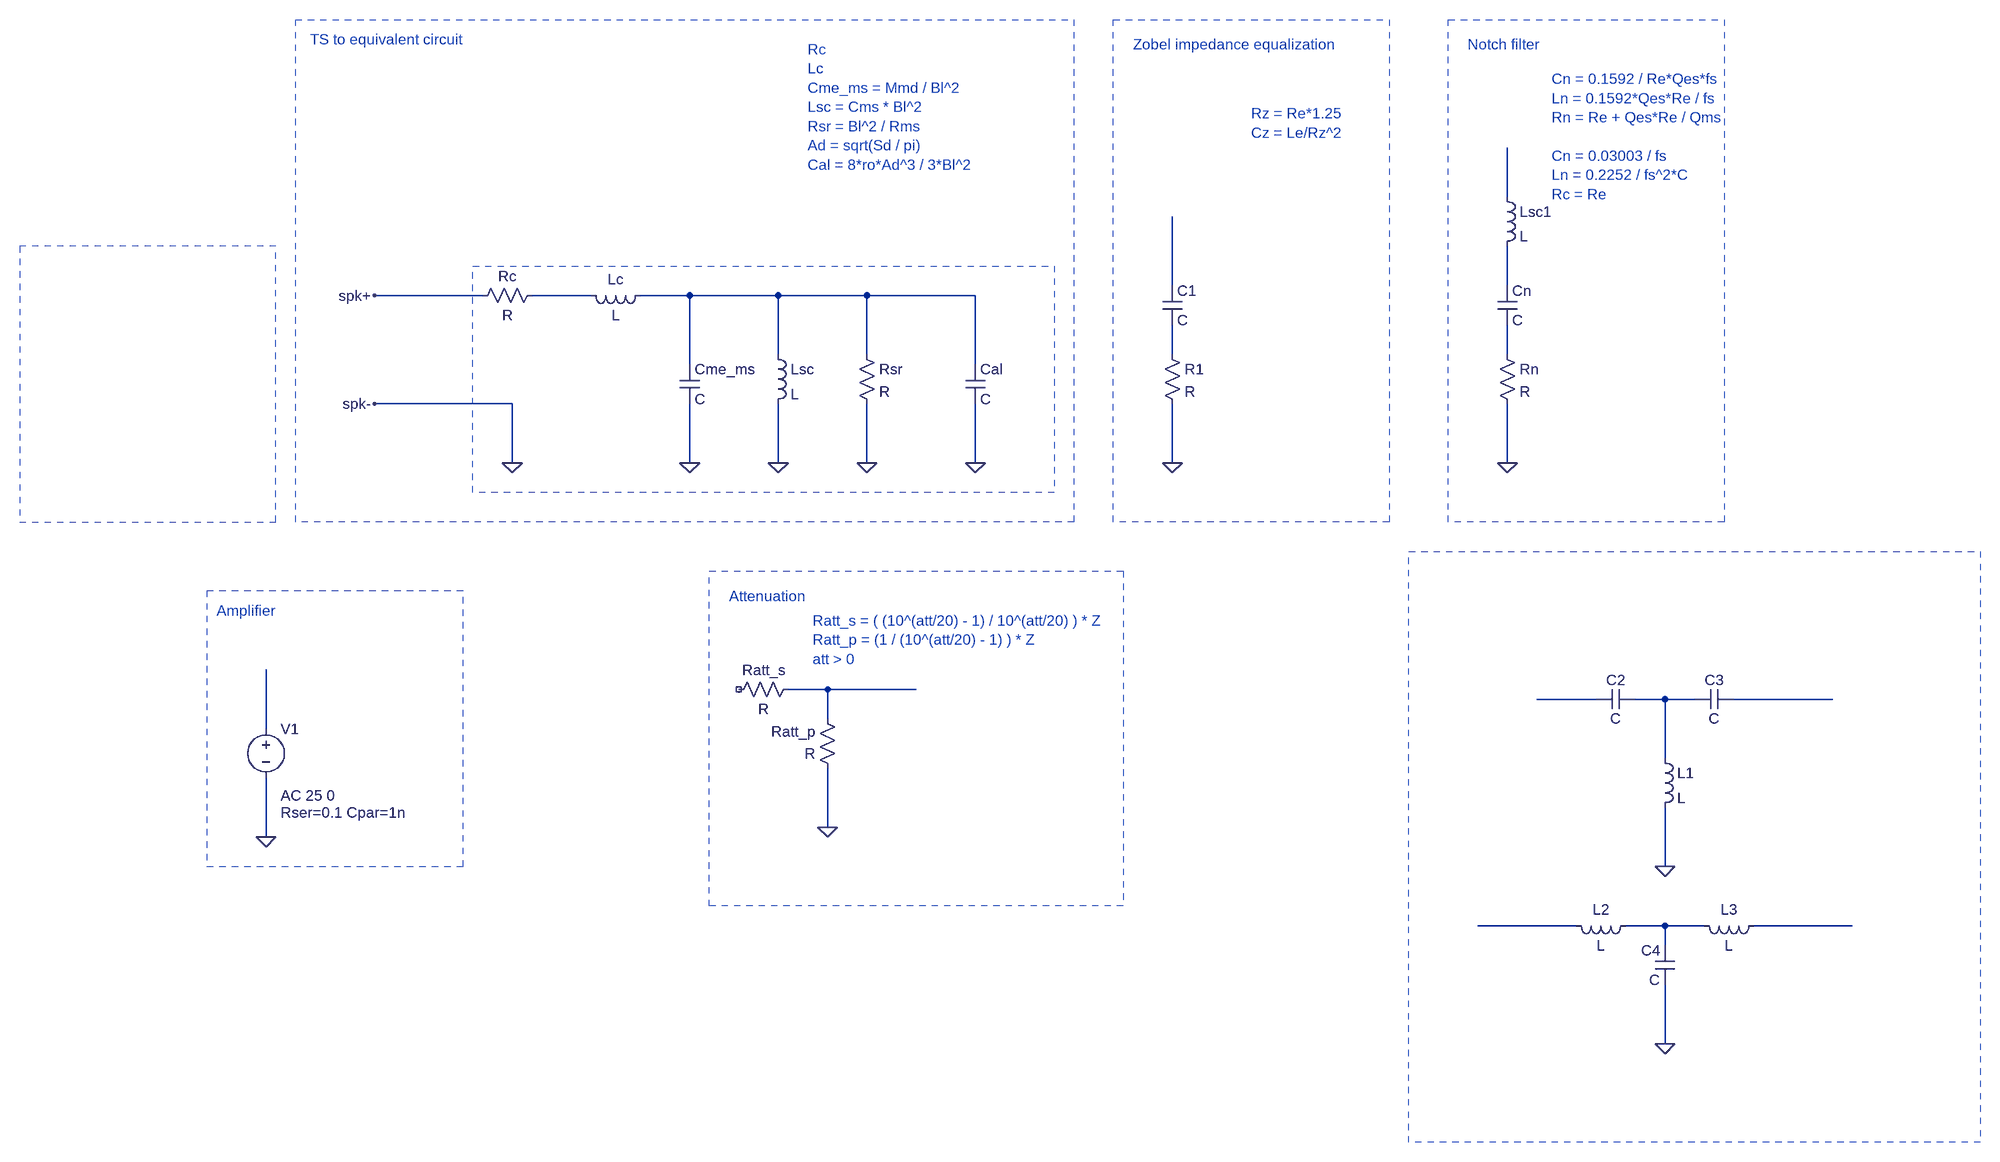
[diagram p0: schematic passive-audio-circuits.asc]
passive-audio-circuits.asc, the LTspice schematic file:
Version 4
SHEET 1 2452 1460
WIRE 1680 -80 1680 -160
WIRE 1136 64 1136 -48
WIRE 1680 64 1680 0
WIRE 16 80 -160 80
WIRE 192 80 96 80
WIRE 352 80 272 80
WIRE 496 80 352 80
WIRE 640 80 496 80
WIRE 816 80 640 80
WIRE 496 176 496 80
WIRE 640 176 640 80
WIRE 1136 176 1136 128
WIRE 1680 176 1680 128
WIRE 352 192 352 80
WIRE 816 192 816 80
WIRE 64 256 -160 256
WIRE 64 352 64 256
WIRE 352 352 352 256
WIRE 496 352 496 256
WIRE 640 352 640 256
WIRE 816 352 816 256
WIRE 1136 352 1136 256
WIRE 1680 352 1680 256
WIRE 576 720 512 720
WIRE 720 720 576 720
WIRE 1824 736 1728 736
WIRE 1936 736 1888 736
WIRE 1984 736 1936 736
WIRE 2208 736 2048 736
WIRE 576 768 576 720
WIRE -336 784 -336 688
WIRE 1936 832 1936 736
WIRE 576 944 576 848
WIRE -336 960 -336 864
WIRE 1936 1008 1936 912
WIRE 1792 1104 1632 1104
WIRE 1936 1104 1872 1104
WIRE 2000 1104 1936 1104
WIRE 2240 1104 2080 1104
WIRE 1936 1136 1936 1104
WIRE 1936 1296 1936 1200
FLAG 352 352 0
FLAG 496 352 0
FLAG 640 352 0
FLAG 816 352 0
FLAG -336 960 0
FLAG 1136 352 0
FLAG 64 352 0
FLAG -160 80 spk+
FLAG -160 256 spk-
FLAG 576 944 0
FLAG 1680 352 0
FLAG 1936 1296 0
FLAG 1936 1008 0
SYMBOL res 112 64 R90
WINDOW 0 0 56 VBottom 2
WINDOW 3 32 56 VTop 2
SYMATTR InstName Rc
SYMBOL res 624 160 R0
SYMATTR InstName Rsr
SYMBOL ind 288 64 R90
WINDOW 0 5 56 VBottom 2
WINDOW 3 32 56 VTop 2
SYMATTR InstName Lc
SYMBOL ind 480 160 R0
SYMATTR InstName Lsc
SYMBOL cap 336 192 R0
SYMATTR InstName Cme_ms
SYMBOL cap 800 192 R0
SYMATTR InstName Cal
SYMBOL voltage -336 768 R0
WINDOW 123 24 124 Left 2
WINDOW 39 24 152 Left 2
SYMATTR Value2 AC 25 0
SYMATTR SpiceLine Rser=0.1 Cpar=1n
SYMATTR InstName V1
SYMATTR Value ""
SYMBOL cap 1120 64 R0
SYMATTR InstName C1
SYMBOL res 1120 160 R0
SYMATTR InstName R1
SYMBOL res 528 704 R90
WINDOW 0 0 56 VBottom 2
WINDOW 3 32 56 VTop 2
SYMATTR InstName Ratt_s
SYMBOL res 592 864 R180
WINDOW 0 36 76 Left 2
WINDOW 3 36 40 Left 2
SYMATTR InstName Ratt_p
SYMBOL cap 1664 64 R0
SYMATTR InstName Cn
SYMBOL res 1664 160 R0
SYMATTR InstName Rn
SYMBOL ind 1664 -96 R0
SYMATTR InstName Lsc1
SYMBOL cap 1888 720 R90
WINDOW 0 0 32 VBottom 2
WINDOW 3 32 32 VTop 2
SYMATTR InstName C2
SYMBOL cap 2048 720 R90
WINDOW 0 0 32 VBottom 2
WINDOW 3 32 32 VTop 2
SYMATTR InstName C3
SYMBOL cap 1952 1200 R180
WINDOW 0 24 56 Left 2
WINDOW 3 24 8 Left 2
SYMATTR InstName C4
SYMBOL ind 1920 816 R0
SYMATTR InstName L1
SYMBOL ind 1888 1088 R90
WINDOW 0 5 56 VBottom 2
WINDOW 3 32 56 VTop 2
SYMATTR InstName L2
SYMBOL ind 2096 1088 R90
WINDOW 0 5 56 VBottom 2
WINDOW 3 32 56 VTop 2
SYMATTR InstName L3
TEXT 544 -320 Left 2 ;Rc\nLc\nCme_ms = Mmd / Bl^2\nLsc = Cms * Bl^2\nRsr = Bl^2 / Rms\nAd = sqrt(Sd / pi)\nCal = 8*ro*Ad^3 / 3*Bl^2
TEXT -264 -336 Left 2 ;TS to equivalent circuit
TEXT 1264 -216 Left 2 ;Rz = Re*1.25\nCz = Le/Rz^2
TEXT 1072 -328 Left 2 ;Zobel impedance equalization
TEXT -416 592 Left 2 ;Amplifier
TEXT 416 568 Left 2 ;Attenuation
TEXT 552 608 Left 2 ;Ratt_s = ( (10^(att/20) - 1) / 10^(att/20) ) * Z\nRatt_p = (1 / (10^(att/20) - 1) ) * Z\natt > 0
TEXT 1752 -272 Left 2 ;Cn = 0.1592 / Re*Qes*fs\nLn = 0.1592*Qes*Re / fs\nRn = Re + Qes*Re / Qms\n \nCn = 0.03003 / fs\nLn = 0.2252 / fs^2*C\nRc = Re
TEXT 1616 -328 Left 2 ;Notch filter
RECTANGLE Normal 976 448 -288 -368 2
RECTANGLE Normal 1488 448 1040 -368 2
RECTANGLE Normal 944 400 0 32 2
RECTANGLE Normal -16 560 -432 1008 2
RECTANGLE Normal -320 0 -736 448 2
RECTANGLE Normal 1056 1072 384 528 2
RECTANGLE Normal 2032 448 1584 -368 2
RECTANGLE Normal 2448 1456 1520 496 2

The netlist it stands for:
* passive-audio-circuits.asc
Rc N004 spk+ R
Rsr N005 0 R
Lc N005 N004 L
Lsc N005 0 L
Cme_ms N005 0 C
Cal N005 0 C
V1 N012 0 AC 25 0 Rser=0.1 Cpar=1n
C1 N002 N006 C
R1 N006 0 R
Ratt_s N008 NC_01 R
Ratt_p 0 N008 R
Cn N003 N007 C
Rn N007 0 R
Lsc1 N001 N003 L
C2 N010 N009 C
C3 N011 N010 C
C4 0 N014 C
L1 N010 0 L
L2 N014 N013 L
L3 N015 N014 L
* Rc
* Lc
* Cme_ms = Mmd / Bl^2
* Lsc = Cms * Bl^2
* Rsr = Bl^2 / Rms
* Ad = sqrt(Sd / pi)
* Cal = 8*ro*Ad^3 / 3*Bl^2
* TS to equivalent circuit
* Rz = Re*1.25
* Cz = Le/Rz^2
* Zobel impedance equalization
* Amplifier
* Attenuation
* Ratt_s = ( (10^(att/20) - 1) / 10^(att/20) ) * Z
* Ratt_p = (1 / (10^(att/20) - 1) ) * Z
* att > 0
* Cn = 0.1592 / Re*Qes*fs
* Ln = 0.1592*Qes*Re / fs
* Rn = Re + Qes*Re / Qms
* Cn = 0.03003 / fs
* Ln = 0.2252 / fs^2*C
* Rc = Re
* Notch filter
.backanno
.end